# EAGLE design coqui-v0.2 (EAGLE 7.2.0)
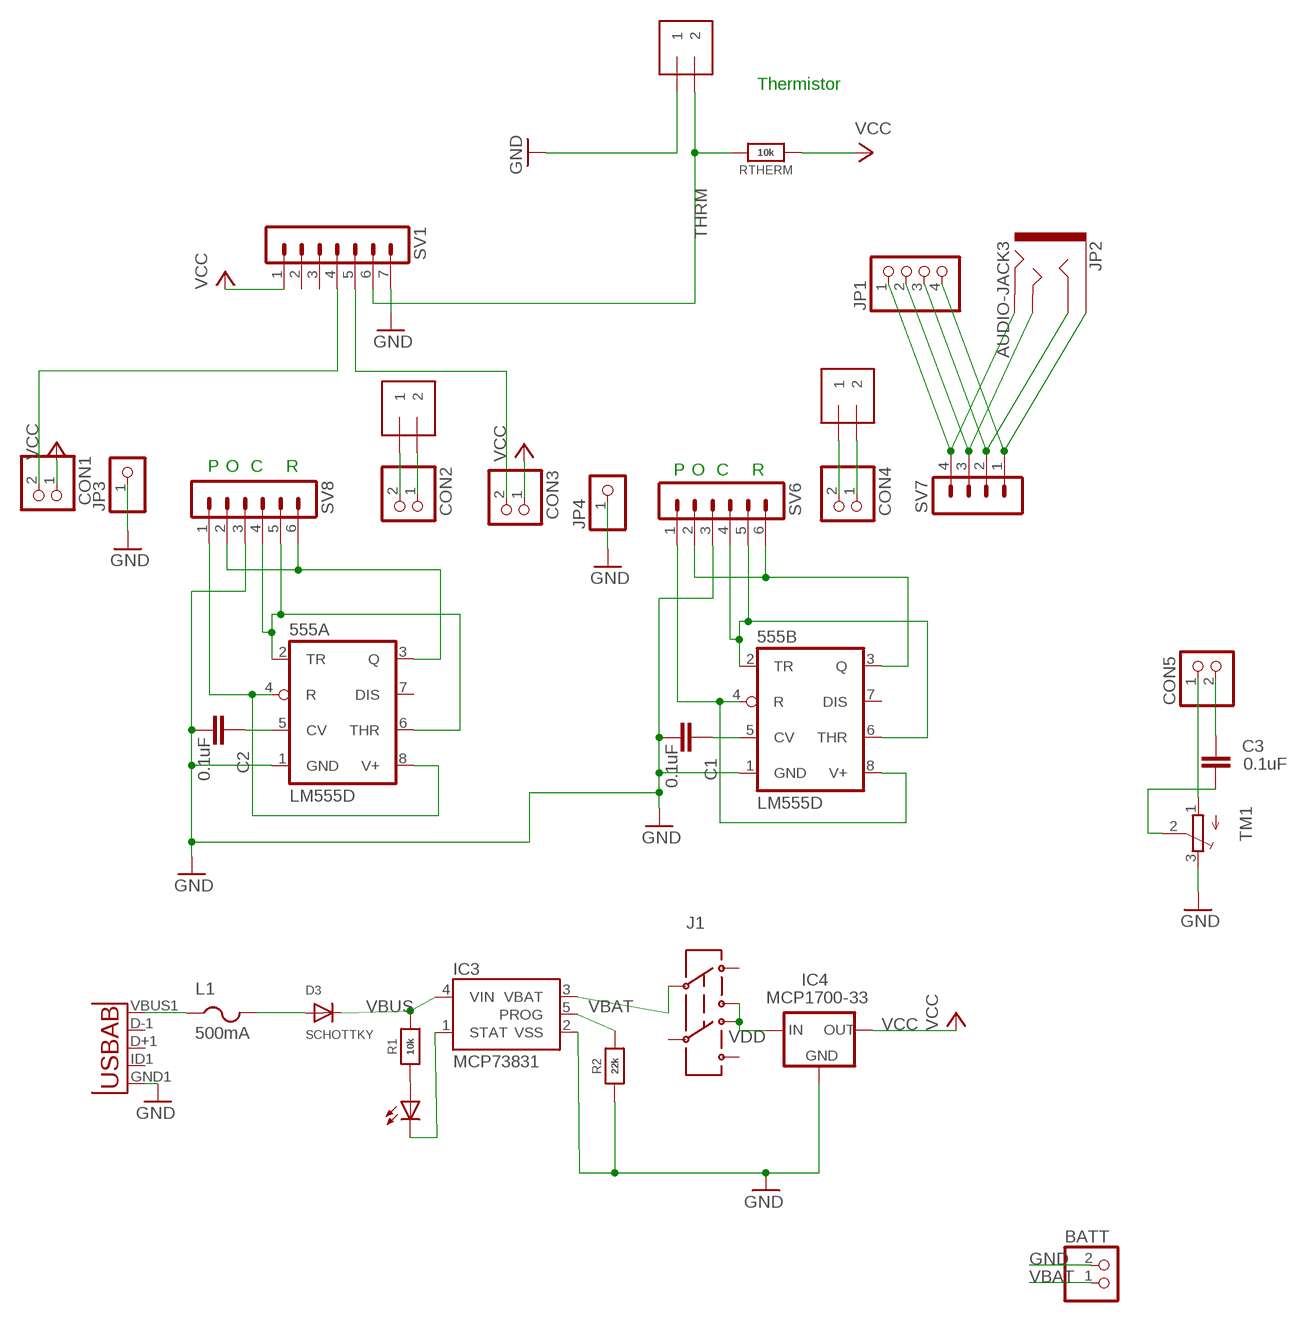
[diagram p0: schematic, sheet 1]

## Parts
555A  LM555D  [SO08]
555B  LM555D  [SO08]
BATT  JST_2PIN-SMT-RA  [JST-PH-2-SMT-RA]
C1  0.1uF  CAP0603-CAP  [0603-CAP]
C2  0.1uF  CAP0603-CAP  [0603-CAP]
C3  0.1uF  CAP0603-CAP  [0603-CAP]
CHG  0805  LEDCHIPLED_0805  [CHIPLED_0805]
CON1  PINHD-1X2  [1X02]
CON2  PINHD-1X2  [1X02]
CON3  PINHD-1X2  [1X02]
CON4  PINHD-1X2  [1X02]
CON5  PINHD-1X2  [1X02]
D3  SCHOTTKY  DIODE_SOD-123FL  [SOD-123FL]
IC3  MCP73831  [SOT23-5]
IC4  MCP1700-33  MCP1700SOT89  [SOT89]
IN1  1X2-3.5MM  [1X2-3.5MM]
IN2  1X2-3.5MM  [1X2-3.5MM]
J1  AYZ0202  [AYZ0202]
JP1  PINHD-1X4/90  [1X04/90]
JP2  AUDIO-JACK3  [AUDIO-JACK-TRRS-SMD]
JP3  PINHD-1X1  [1X01]
JP4  PINHD-1X1  [1X01]
L1  500mA  PTCFUSE-1206  [R1206]
R1  10k  RESISTOR_0603_NOOUT  [0603-NO]
R2  22k  RESISTOR_0603_NOOUT  [0603-NO]
RTHERM  10k  RESISTOR_0603_NOOUT  [0603-NO]
SV1  MA07-1  [MA07-1]
SV6  MA06-1  [MA06-1]
SV7  MA04-1  [MA04-1]
SV8  MA06-1  [MA06-1]
THRM  1X2-3.5MM  [1X2-3.5MM]
TM1  TRIMPOTTC33X  [TC33X]
U$4  USB-AB""  [USB-AB-MICRO-SMD_V02_BOSS]

## Nets
AOUT: 555A.3(Q) SV8.2 SV8.6
AOUT1: 555B.3(Q) SV6.2 SV6.6
GND: 555A.1(GND) 555B.1(GND) BATT.2 C1.1 C2.1 IC3.2(VSS) IC4.1(GND) JP3.1 JP4.1 R2.1 SV1.7 SV6.3 SV8.3 THRM.1 TM1.3(E) U$4.GND1(GND)
N$1: 555B.2(TR) 555B.6(THR) SV6.4 SV6.5
N$2: 555B.5(CV) C1.2
N$3: IC3.5(PROG) R2.2
N$4: CHG.A R1.1
N$5: CHG.C IC3.1(STAT)
N$6: JP1.4 JP2.EARTH SV7.1
N$7: JP1.3 JP2.RING1 SV7.2
N$8: JP1.2 JP2.TIP SV7.3
N$9: JP1.1 JP2.RING2 SV7.4
N$10: CON2.2 IN1.1
N$11: 555A.2(TR) 555A.6(THR) SV8.4 SV8.5
N$12: L1.1 U$4.VBUS1(VBUS)
N$13: D3.A L1.2
N$14: 555A.5(CV) C2.2
N$15: CON2.1 IN1.2
N$16: CON4.2 IN2.1
N$17: CON4.1 IN2.2
N$18: CON1.2 SV1.4
N$19: CON3.2 SV1.5
N$20: CON5.1 TM1.1(A)
N$21: C3.2 CON5.2
N$22: C3.1 TM1.2(S)
THRM: RTHERM.2 SV1.6 THRM.2
VAIN: 555A.4(R) 555A.8(V+) SV8.1
VAIN1: 555B.4(R) 555B.8(V+) SV6.1
VBAT [vcc]: BATT.1 IC3.3(VBAT) J1.2
VBUS [vcc]: D3.C IC3.4(VIN) R1.2
VCC: CON1.1 CON3.1 IC4.3(OUT) RTHERM.1 SV1.1
VDD: IC4.2(IN) J1.1 J1.6
Unconnected: 555A.7(DIS) 555B.7(DIS) J1.3 J1.4 J1.5 SV1.2 SV1.3 U$4.D+1(D+) U$4.D-1(D-) U$4.ID1(USBID)

## Notes on the sheet
- Thermistor
- P | O | C | R | P | O | C | R

## Library data of the parts
555A 555B = adafruit:*555: TIMER Changed DIP package to have round (not oval) pin pads http://www.ladyada.net/library/pcb/eaglelibrary.html
BATT = adafruit:JST_2PIN: JST 2-Pin Connectors of various flavors SMT-RA (S2B-PH-SM4) 4UConnector #17311 SMT (B2B-PH-SM4) THM-RA (S2B-PH) THM (B2B-PH)
C1-C3 = SparkFun:CAP: Capacitor Standard 0603 ceramic capacitor, and 0.1" leaded capacitor.
CHG = led:LED: LED OSRAM: - CHIPLED LG R971, LG N971, LY N971, LG Q971, LY Q971, LO R971, LY R971 LH N974, LH R974 LS Q976, LO Q976, LY Q976 LO Q996 - Hyper CHIPLED LW Q18S LB Q993, LB Q99A, LB R99A - SideLED LS A670, LO A670, LY A670, LG A670, LP A670 LB A673, LV A673, LT A673, LW A673 LH A674 LY A675 LS A676, LA A676, LO A676, LY A676, LW A676 LS A679, LY A679, LG A679 - Hyper Micro SIDELED® LS Y876, LA Y876, LO Y876, LY Y876 LT Y87S - SmartLED LW L88C, LW L88S LB L89C, LB L89S, LG L890 LS L89K, LO L89K, LY L89K LS L896, LA L896, LO L896, LY L896 - TOPLED LS T670, LO T670, LY T670, LG T670, LP T670 LSG T670, LSP T670, LSY T670, LOP T670, LYG T670 LG T671, LOG T671, LSG T671 LB T673, LV T673, LT T673, LW T673 LH T674 LS T676, LA T676, LO T676, LY T676, LB T676, LH T676, LSB T676, LW T676 LB T67C, LV T67C, LT T67C, LS T67K, LO T67K, LY T67K, LW E67C LS E67B, LA E67B, LO E67B, LY E67B, LB E67C, LV E67C, LT E67C LW T67C LS T679, LY T679, LG T679 LS T770, LO T770, LY T770, LG T770, LP T770 LB T773, LV T773, LT T773, LW T773 LH T774 LS E675, LA E675, LY E675, LS T675 LS T776, LA T776, LO T776, LY T776, LB T776 LHGB T686 LT T68C, LB T68C - Hyper Mini TOPLED® LB M676 - Mini TOPLED Santana® LG M470 LS M47K, LO M47K, LY M47K Source: http://www.osram.convergy.de LUXEON: - LUMILED® LXK2-PW12-R00, LXK2-PW12-S00, LXK2-PW14-U00, LXK2-PW14-V00 LXK2-PM12-R00, LXK2-PM12-S00, LXK2-PM14-U00 LXK2-PE12-Q00, LXK2-PE12-R00, LXK2-PE12-S00, LXK2-PE14-T00, LXK2-PE14-U00 LXK2-PB12-K00, LXK2-PB12-L00, LXK2-PB12-M00, LXK2-PB14-N00, LXK2-PB14-P00, LXK2-PB14-Q00 LXK2-PR12-L00, LXK2-PR12-M00, LXK2-PR14-Q00, LXK2-PR14-R00 LXK2-PD12-Q00, LXK2-PD12-R00, LXK2-PD12-S00 LXK2-PH12-R00, LXK2-PH12-S00 LXK2-PL12-P00, LXK2-PL12-Q00, LXK2-PL12-R00 Source: www.luxeon.com KINGBRIGHT: KA-3528ASYC Source: www.kingbright.com
CON1-CON5 = pinhead:PINHD-1X2: PIN HEADER
D3 = adafruit:DIODE: Diode SMADIODE - SMA Surface Mount Package 20V 1A Schottky Diode Digikey: 641-1014-6-ND DO-1N4148 - Through Hole Small Current Diode SOD-123 20V 1 A (.5mV Vf) Schottky Diode - Digikey: MBRX120TPMSCT-ND SOD-323 10V 570mA (.38mV Vf, 3ns) Schottky Diode - Digikey: ZLLS410CT-ND SOD-523 30V 30mA Schottky Diode (RB751S-40TE61) - Digikey: RB751S-40TE61CT-ND SOT23-R/W - SOT23 Package (R = Solder Paste/Reflow Ovens, W = Hand-Soldering) BAT54Film 40V 300mA - Digikey: 497-7162-1-ND
IC3 = SparkFunNew:MCP73831: Microchip's MCP73831 Miniature single cell, fully integrated Li-Ion, Li-polymer charge management controller http://ww1.microchip.com/downloads/en/DeviceDoc/21984a.pdf
IC4 = adafruit:MCP1700: VOLTAGE REGULATOR
IN1 IN2 THRM = adafruit:1X2: 3.5mm Terminal block http://www.ladyada.net/library/pcb/eaglelibrary.html
J1 = SparkFunNew:AYZ0202: SPDT Slide Switch Simple SMD single-pull double-throw slide switch. Good for less than 350mA power switch, switching UARTs between devices, etc. Spark Fun Electronics SKU : COM-00597
JP1 = trrs-dwb:PINHD-1X4: PIN HEADER
JP2 = SparkFun-Connectors:AUDIO-JACK3: Audio jack - 3.5mm TRRS variety - two rings.
JP3 JP4 = pinhead:PINHD-1X1: PIN HEADER
L1 = adafruit:PTCFUSE: PTC fuses, resettable thermistors
R1 R2 RTHERM = microbuilder:RESISTOR: Resistors For new designs, use the packages preceded by an '_' character since they are more reliable: The following footprints should be used on most boards: _0402 - Standard footprint for regular board layouts _0603 - Standard footprint for regular board layouts _0805 - Standard footprint for regular board layouts _1206 - Standard footprint for regular board layouts For extremely tight-pitch boards where space is at a premium, the following 'micro-pitch' footprints can be used (smaller pads, no silkscreen outline, etc.): _0402MP - Micro-pitch footprint for very dense/compact boards _0603MP - Micro-pitch footprint for very dense/compact boards _0805MP - Micro-pitch footprint for very dense/compact boards _1206MP - Micro-pitch footprint for very dense/compact boards
SV1 = con-lstb:MA07-1: PIN HEADER; OC_FARNELL: unknown; OC_NEWARK: unknown
SV6 SV8 = con-lstb:MA06-1: PIN HEADER; OC_FARNELL: unknown; OC_NEWARK: unknown
SV7 = con-lstb:MA04-1: PIN HEADER; OC_FARNELL: unknown; OC_NEWARK: unknown
TM1 = adafruit:TRIMPOT: SMT trimmer potentiometer part number TC33X http://www.ladyada.net/library/eagle
U$4 = Testing:USB-AB: This is a USB AB connector that is compatible with USB OTG. i.e. this connector can serve as a host or device

## Board
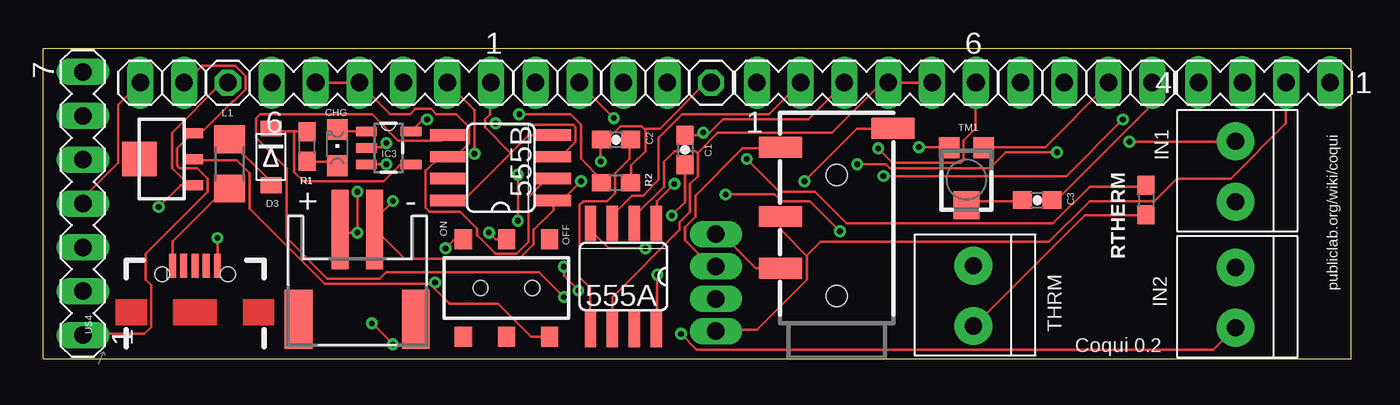
[diagram p1: board, top side]
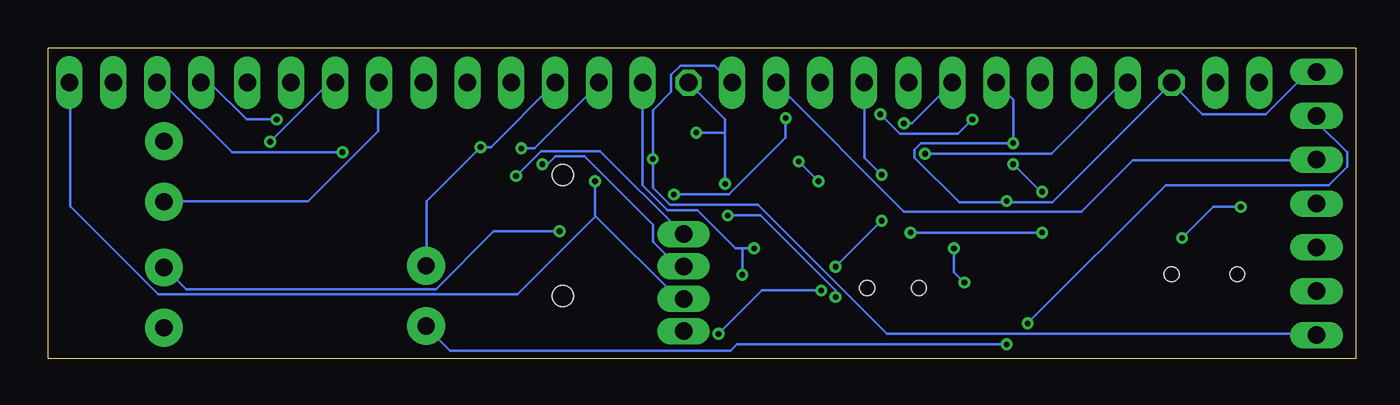
[diagram p2: board, bottom side, seen from below]

Size 75.79 x 18 mm. Coordinates in mm from the lower left corner, seen from the top.
Outline: 0,0 0,18 75.79,18 75.79,0 0,0
Copper layers (1*16): Top 0.0356mm / dielectric 1.5011mm / Bottom 0.0356mm
Design rules "LaenPCBOrder": minimum track width 6mil, minimum drill 13mil, track to track 6mil, track to pad 6mil, pad to pad 6mil, via to via 6mil, smd to smd 6mil, copper to edge 15mil, drill to drill 6mil, minimum pad ring 7mil, minimum via ring 7mil, stop-mask expansion 3mil, vias tented up to drill 0mil, thermal gap 10mil

### Footprints (pad centres in the part's own frame; a part is rotated, then mirrored left to right if it is on the bottom)
SO08 = smd 0.66 x 2.032: 1 -1.905,-3.073; 2 -0.635,-3.073; 3 0.635,-3.073; 4 1.905,-3.073; 5 1.905,3.073; 6 0.635,3.073; 7 -0.635,3.073; 8 -1.905,3.073
JST-PH-2-SMT-RA = smd 1 x 4.6: 1 1,-3.7; 2 -1,-3.7 | smd 1.6 x 3.4: NC1 -3.4,1.5; NC2 3.4,1.5
0603-CAP = smd 1.1 x 1: 1 -0.85,0; 2 0.85,0
CHIPLED_0805 = smd 1.2 x 1.2: A 0,-1.05; C 0,1.05
1X02 = drill 1.016 long: 1 -1.27,0; 2 1.27,0
SOD-123FL = smd 0.91 x 1.22: A 1.637,0; C -1.637,0
SOT23-5 = smd 0.55 x 1.2: 1 -0.95,-1.3; 2 0,-1.3; 3 0.95,-1.3; 4 0.95,1.3; 5 -0.95,1.3
SOT89 = smd 0.58 x 1.2: 1 -1.5,-1.8; 2 0,-1.8; 3 1.5,-1.8 | smd 2 x 2: 4 0,1.3
1X2-3.5MM = drill 1 pad 2.184: 1 1.8,0; 2 -1.7,0
AYZ0202 = smd 1 x 1.15: 1 -2.5,2.825; 2 0,2.825; 3 2.5,2.825; 4 -2.5,-2.825; 5 0,-2.825; 6 2.5,-2.825 | hole 0.85: 1.5,0; -1.5,0
1X04/90 = drill 1.016 long: 1 2.928,-2.286; 2 1.053,-2.286; 3 -2.697,-2.286; 4 -0.822,-2.286
AUDIO-JACK-TRRS-SMD = smd 1.2 x 2.5: EARTH 11.3,-3.25; RING1 6.2,3.25; RING2 3.2,3.25; TIP 10.2,3.25 | hole 1.2: 1.6,0; 8.6,0
1X01 = drill 1.016 octagon: 1 0,0
R1206 = smd 1.6 x 1.803: 1 -1.422,0; 2 1.422,0
0603-NO = smd 1.1 x 1: 1 -0.85,0; 2 0.85,0
MA07-1 = drill 1.016 long: 1 -7.62,0; 2 -5.08,0; 3 -2.54,0; 4 0,0; 5 2.54,0; 6 5.08,0; 7 7.62,0
MA06-1 = drill 1.016 long: 1 -6.35,0; 2 -3.81,0; 3 -1.27,0; 4 1.27,0; 5 3.81,0; 6 6.35,0
MA04-1 = drill 1.016 long: 1 -3.81,0; 2 -1.27,0; 3 1.27,0; 4 3.81,0
TC33X = smd 1.2 x 1.2: 1 -1,-1.825; 3 1,-1.825 | smd 1.5 x 1.6: 2 0,1.5
USB-AB-MICRO-SMD_V02_BOSS = smd 1.4 x 0.4: D+1 2.7,0; D-1 2.7,0.65; GND1 2.7,-1.3; ID1 2.7,-0.65; VBUS1 2.7,1.3 | hole 0.85: 2.2,1.9; 2.2,-1.9

### Placement (x,y rotation side)
555A  33.62,4.77 180 top
555B  26.51,11.07 90 top
BATT  18.21,3.79 180 top
C1  37.2,12.1 270 top
C2  33.2,12.7 0 top
C3  57.6,9.2 0 top
CHG  17.04,12.24 0 top
CON1  6.9,16 180 top
CON2  57.9,16 0 top
CON3  34.9,16 180 top
CON4  29.8,16 0 top
CON5  63,16 0 top
D3  13.2,11.7 270 top
IC3  20.02,12.22 270 top
IC4  6.87,11.57 90 top
IN1  69.1,10.8 90 top
IN2  69.1,3.5 90 top
J1  26.85,4.1 0 top
JP1  36.7,4.3 90 top
JP2  45.98,2.05 90 top
JP3  38.7,16 0 top
JP4  10.7,16 0 top
L1  10.8,11.3 90 top
R1  15.3,12.3 90 top
R2  33.2,10.2 180 top
RTHERM  63.9,9.2 270 top
SV1  2.3,9 90 top
SV6  19.6,16 180 top
SV7  70.76,16 180 top
SV8  47.7,16 0 top
THRM  53.9,3.6 90 top
TM1  53.5,10.4 180 top
U$4  8.8,2.7 90 top

### Tracks (layer width: path | path; a pad name or v marks a point on that pad's centre or on a via)
AOUT  (via drill 0.33)
  Top 0.152: 555A.3 32.99,8.31 34.14,9.45 34.75,9.45 35.66,10.36 35.66,12.8 37.03,14.17 42.06,14.17 43.81,15.93 SV8.2 | v48.39,12.19 49.23,11.35 53.19,11.35 53.34,11.51 53.34,12.65 54.03,13.34 54.03,15.93 SV8.6
  Bottom 0.152: v48.39,12.19 47.62,12.19 43.89,15.93 SV8.2
AOUT1  (via drill 0.33)
  Top 0.152: v26.21,13.64 26.29,13.56 30.71,13.56 30.86,13.41 30.86,12.57 30.02,11.73 29.64,11.73 555B.3 | v24.99,11.89 24.99,14.4 23.47,15.93 SV6.2
  Bottom 0.152: v26.21,13.64 25.76,13.64 23.47,15.93 SV6.2 | v24.99,11.89 17.68,11.89 13.64,15.93 13.26,15.93 SV6.6
GND  (via drill 0.33)
  Top 0.152: 34.86,13.3 34.67,13.49 33.45,13.49 32.69,12.72 32.38,12.72 C2.1 32.31,12.65 v32.31,11.43 | 34.86,13.3 34.9,13.26 34.9,12.04 34.06,11.2 34.06,10.21 R2.1 | v36.58,10.13 35.59,9.14 35.59,7.85 555A.1 | 34.86,13.3 34.9,13.34 35.74,13.34 38.33,15.93 38.63,15.93 JP3.1 | 38.25,12.95 38.48,12.95 39.4,13.87 44.35,13.87 46.41,15.93 SV8.3 | 38.25,12.95 37.26,12.95 C1.1 | v50.75,12.27 52.43,12.27 TM1.3 | 38.25,12.95 v38.25,13.11 | v19.89,12.5 19.66,12.27 18.75,12.27 IC3.2 | JP4.1 10.67,15.93 10.29,15.93 7.47,13.11 7.47,11.05 8.38,10.13 8.61,10.13 IC4.1 7.97,10.07 v6.7,8.8 | v20.27,9.14 19.28,8.15 19.28,7.54 BATT.2 19.28,7.47 20.95,5.79 27.58,5.79 28.42,6.63 28.42,7.47 29.57,8.61 29.57,9.14 555B.1 29.64,9.22 30.1,9.22 v31.17,10.29 | U$4.GND1 v10.1,7
  Bottom 0.152: 36.58,13.11 36.58,13.87 38.63,15.93 JP3.1 | 36.58,13.11 v36.58,10.13 | SV8.3 46.48,15.93 50.14,12.27 v50.75,12.27 53.87,9.14 53.87,5.41 THRM.1 | v38.25,13.11 36.58,13.11 | SV6.3 20.8,15.93 19.89,15.01 v19.89,12.5 25.22,12.5 25.6,12.12 25.6,11.66 23.01,9.07 20.27,9.07 | SV1.7 2.36,16.61 2.82,16.61 5.26,14.17 8.91,14.17 10.67,15.93 JP4.1 10.74,15.93 17.6,9.07 20.27,9.07 | 20.27,9.07 v20.27,9.14 | v31.17,10.29 v32.31,11.43 | v10.1,7 8.3,8.8 v6.7,8.8
N$1
  Top 0.152: 555B.2 29.57,10.36 29.11,10.36 28.12,9.37 28.12,6.78 27.43,6.1 26.21,6.1 25.15,7.16 25.15,7.54 24.16,8.53 22.4,8.53 22.17,8.76 22.17,10.9 22.94,11.66 23.39,11.66 555B.6 23.47,11.73 23.93,11.73 24.69,12.5 24.69,13.41 23.93,14.17 22.78,14.17 22.48,14.48 21.57,14.48 21.26,14.17 20.12,14.17 18.36,15.93 SV6.4 18.29,16 15.85,16 SV6.5
N$2  (via drill 0.33)
  Top 0.152: v36.42,8.31 37.19,9.07 37.19,11.2 C1.2 | v30.18,3.58 28.73,5.03 19.89,5.03 19.51,4.65 16.46,4.65 14.1,7.01 14.1,11.05 12.34,12.8 12.34,13.95 12.57,14.17 19.05,14.17 20.57,12.65 23.09,12.65 23.39,12.95 555B.5
  Bottom 0.152: v36.42,8.31 34.52,8.31 30.18,3.96 v30.18,3.58
N$3  (via drill 0.33)
  Top 0.152: v27.58,14.17 30.56,14.17 31.17,13.56 31.17,11.58 32.31,10.44 32.31,10.21 R2.2 | v22.25,13.87 22.02,13.87 21.34,13.18 IC3.5
  Bottom 0.152: v27.58,14.17 26.44,13.03 23.09,13.03 v22.25,13.87
N$4
  Top 0.152: R1.1 15.32,11.43 16.76,11.43 16.99,11.2 CHG.A
N$5
  Top 0.152: IC3.1 18.67,13.18 17.14,13.18 17.07,13.26 CHG.C
N$6  (via drill 0.33)
  Top 0.152: v44.12,10.29 47.17,13.34 49.23,13.34 JP2.EARTH
  Bottom 0.152: v44.12,10.29 44.12,8.31 44.08,8.27 | 44.08,8.27 39.32,3.5 39.01,3.5 JP1.4 | 44.08,8.27 48.62,3.73 69.42,3.73 74.52,8.84 74.52,16 SV7.1
N$7
  Top 0.152: 44.23,5.98 44.27,5.94 44.27,4.57 41.38,1.68 39.01,1.68 JP1.3 | 44.23,5.98 42.75,7.47 42.75,8.23 JP2.RING1 | 44.23,5.98 45.03,6.78 58.29,6.78 60.66,9.14 64.39,9.14 65.68,10.44 68.81,10.44 72.01,13.64 72.01,16 SV7.2
N$8  (via drill 0.33)
  Top 0.152: JP2.TIP 42.67,12.19 40.54,12.19 37.8,9.45 37.8,8.23 37.19,7.62 37.19,6.86 38.63,5.41 38.94,5.41 JP1.2 | v58.75,11.96 55.78,11.96 54.86,11.05 49.07,11.05 48.84,11.28 v47.17,11.28
  Bottom 0.152: SV7.3 69.19,16 65.15,11.96 v58.75,11.96 | v47.17,11.28 46.86,11.28 46.41,11.73 44.73,11.73 40.77,7.77 40.77,6.78 39.4,5.41 39.01,5.41 JP1.2
N$9  (via drill 0.33)
  Top 0.152: JP2.RING2 42.67,5.26 41.3,5.26 39.4,7.16 39.01,7.16 JP1.1 | v62.56,13.87 59.28,10.59 v48.69,10.59
  Bottom 0.152: SV7.4 66.45,16 64.31,13.87 v62.56,13.87 | v48.69,10.59 47.24,12.04 43.81,12.04 39.01,7.24 JP1.1
N$10  (via drill 0.33)
  Top 0.152: v62.94,12.57 69.04,12.57 IN1.1
  Bottom 0.152: v62.94,12.57 59.59,15.93 59.21,15.93 CON2.2
N$11
  Top 0.152: SV8.5 51.44,16 49,16 SV8.4 48.92,15.93 48.54,15.93 45.72,13.11 39.09,13.11 37.91,11.93 | 37.91,11.93 37.8,12.04 36.58,12.04 35.97,11.43 35.97,9.98 34.29,8.31 34.29,7.85 555A.2 | 37.91,11.93 37.95,11.89 37.95,10.59 37.49,10.13 37.49,8.53 36.88,7.92 36.88,7.47 32.99,3.58 32.99,1.75 555A.6
N$12
  Top 0.152: U$4.VBUS1 7.5,6.8 10.58,9.88 L1.1
N$13
  Top 0.152: D3.A 13.18,10.13 13.18,10.29 10.82,12.65 L1.2
N$14
  Top 0.152: C2.2 33.98,12.65 33.98,11.58 33.15,10.74 33.15,9.6 32.69,9.14 31.32,9.14 31.09,8.91 31.09,4.72 31.7,4.12 31.7,1.75 555A.5
N$15
  Bottom 0.152: CON2.1 56.69,15.93 56.69,13.18 60.73,9.14 69.04,9.14 IN1.2
N$16  (via drill 0.33)
  Top 0.152: v33.07,13.95 31.09,15.93 CON4.2 | v39.55,9.53 42.37,9.53 42.75,9.14 44.42,9.14 v46.18,7.39
  Bottom 0.152: v33.07,13.95 33.07,12.8 36.35,9.53 v39.55,9.53 | v46.18,7.39 49.99,7.39 53.34,4.04 67.82,4.04 69.04,5.26 IN2.1
N$17  (via drill 0.33)
  Top 0.152: v27.51,8 v27.51,10.67 | v30.18,5.33 30.18,4.8 v31.01,3.96 | v36.96,1.45 37.87,0.53 67.82,0.53 69.04,1.75 IN2.2
  Bottom 0.152: v27.51,10.67 28.5,11.66 28.5,15.93 CON4.1 | v30.18,5.33 v27.51,8 | v31.01,3.96 34.44,3.96 v36.96,1.45
N$18
  Top 0.152: SV1.4 2.36,9.07 2.36,9.37 4.34,11.35 4.34,14.71 5.56,15.93 CON1.2
N$19
  Bottom 0.152: SV1.5 2.36,11.51 12.95,11.51 15.93,8.53 26.21,8.53 33.6,15.93 CON3.2
N$20
  Top 0.152: TM1.1 54.56,12.27 58.06,12.27 61.72,15.93 CON5.1
N$21
  Top 0.152: C3.2 58.52,9.22 58.75,9.22 64.24,14.71 64.24,15.93 CON5.2
N$22
  Top 0.152: C3.1 56.69,9.14 53.8,9.14 53.57,8.91 TM1.2
THRM  (via drill 0.33)
  Top 0.152: RTHERM.2 63.86,8.31 60.35,8.31 53.95,1.91 THRM.2 | v20.27,0.84 v19.05,2.06
  Bottom 0.152: v19.05,2.06 11.05,10.06 1.6,10.06 0.53,11.12 0.53,11.96 2.29,13.72 2.29,14.02 SV1.6 | v20.27,0.84 35.89,0.84 36.27,0.46 52.5,0.46 53.87,1.83 THRM.2
VAIN  (via drill 0.33)
  Top 0.152: v34.9,6.4 32.77,6.4 31.77,7.39 31.77,7.77 555A.4 | v35.59,4.88 35.59,1.75 555A.8
  Bottom 0.152: 35.59,6.4 35.97,6.4 38.18,8.61 39.93,8.61 41.38,10.06 41.38,15.93 SV8.1 | 35.59,6.4 v34.9,6.4 | 35.59,6.4 v35.59,4.88
VAIN1
  Top 0.152: 27.09,11.93 28.12,12.95 29.57,12.95 555B.4 | 27.09,11.93 24.38,9.22 23.47,9.22 555B.8 | 27.09,11.93 25.6,13.41 25.6,13.87 25.91,14.17 25.91,15.93 SV6.1
VBAT  (via drill 0.33)
  Top 0.152: v25.83,7.32 26.21,6.93 26.82,6.93 J1.2 | BATT.1 17.22,7.47 17.37,7.32 v18.21,7.32 v18.21,9.68 | v19.89,11.28 18.75,11.28 IC3.3
  Bottom 0.152: v18.21,7.32 v25.83,7.32 | v19.89,11.28 18.29,9.68 v18.21,9.68
VBUS
  Top 0.152: 14.55,13.18 13.41,13.18 13.26,13.34 D3.C | 14.55,13.18 15.24,13.18 R1.2 | 14.55,13.18 14.55,10.82 15.09,10.29 19.74,10.29 20.65,11.2 21.26,11.2 IC3.4
VCC  (via drill 0.33)
  Top 0.152: CON1.1 8.23,16 9.22,16.99 11.12,16.99 11.73,16.38 11.73,15.62 11.05,14.94 10.97,14.94 9.14,13.11 8.69,13.11 IC4.3 8.61,13.03 7.77,12.19 7.77,11.2 7.92,11.05 8.91,11.05 9.53,10.44 9.53,9.68 5.94,6.1 5.94,4.57 6.25,4.27 6.25,1.83 5.87,1.45 2.36,1.45 SV1.1 | v40.77,11.58 42.67,9.68 44.73,9.68 46.56,7.85 58.52,7.85 60.66,9.98 63.86,9.98 RTHERM.1
  Bottom 0.152: CON3.1 36.2,16 37.19,16.99 39.17,16.99 39.7,16.46 39.7,15.47 40.77,14.4 v40.77,11.58 40.77,9.91 39.78,8.91 34.67,8.91 27.2,1.45 2.36,1.45 SV1.1
VDD  (via drill 0.33)
  Top 0.152: 22.52,4.23 22.4,4.34 16.31,4.34 11.96,8.69 11.96,10.74 11.2,11.51 8.69,11.51 IC4.2 | 22.52,4.23 23.55,3.2 26.36,3.2 28.27,1.29 29.34,1.29 J1.6 | v23.32,6.4 23.77,6.86 24.31,6.86 J1.1 | 22.52,4.23 v22.71,4.42
  Bottom 0.152: v23.32,6.4 23.32,5.03 v22.71,4.42

### Text on the board
tPlace: publiclab.org/wiki/coqui | ON | OFF | Coqui 0.2